# Altium schematic sheet USB_INT.SchDoc
size A4; SheetNumber: 7; SheetTotal: 7
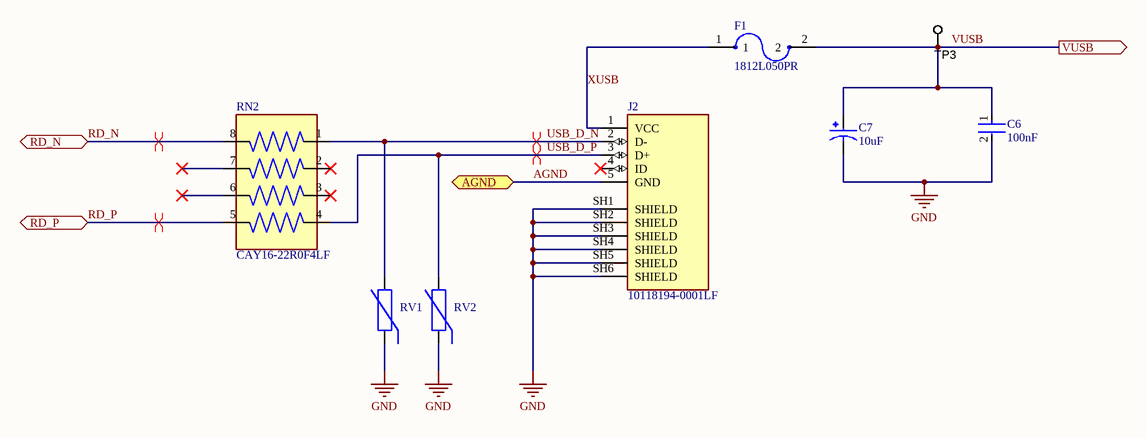
[diagram p0: USB_INT.SchDoc]

## Parts
C6  100nF  [FP-GRT31C-0_2-MFG]
C7  10uF  [CAP_EEEHB1C100AR]
F1  1812L050PR  [FUSM4632X75]
J2  10118194-0001LF  [AMPHENOL_10118194-0001LF]
RN2  CAY16-22R0F4LF  [RESCAF80P320X160X60-8N]
RV1  CG0603MLC-05E  [BOUR-CG0603-2_V]  (value not drawn)
RV2  CG0603MLC-05E  [BOUR-CG0603-2_V]  (value not drawn)
TP3  TESTPOINT_SMD_C1  [TPSMD_C60]  (value not drawn)  (no BOM)

## Ports
AGND (bidir, see OVERVIEW[1D], MCU[2C]), RD_N (bidir, see OVERVIEW[1C], MCU[1B]), RD_P (bidir, see OVERVIEW[1C], MCU[1B]), VUSB (out, see OVERVIEW[1C], MCU[1B], POWER[1B])

## Nets
GND: C6.2 C7.2 J2.SH1(SHIELD) J2.SH2(SHIELD) J2.SH3(SHIELD) J2.SH4(SHIELD) J2.SH5(SHIELD) J2.SH6(SHIELD) RV1.1 RV2.1
AGND: J2.5(GND) ; port AGND
RD_N: RN2.8 ; port RD_N
RD_P: RN2.5 ; port RD_P
USB_D_N: J2.2(D-) RN2.1 RV1.2
USB_D_P: J2.3(D+) RN2.4 RV2.2
VUSB: C6.1 C7.1 F1.2 TP3.1 ; port VUSB
XUSB: F1.1 J2.1(VCC)

Not connected (* = marked no-connect by the designer): J2 4(ID)*; RN2 2* 3* 6* 7*

## Layout directives
differential pair: USB_D_N, USB_D_P
differential pair; differential pair class RD: RD_N, RD_P

## Library data of the parts
C6 = CMP-06035-012780-1: Multi-Layer Ceramic Capacitor 100nF 50V C0G ±1% 1206 Emboss T/R
C7 = EEEHB1C100AR: 10ÂµF 16V Aluminum Electrolytic Capacitors Radial, Can - SMD 2000 Hrs @ 105Â°C; MP: EEE-HB1C100AR; MF: Panasonic; SnapEDA_Link: https://www.snapeda.com/parts/EEE-HB1C100AR/Panasonic/view-part/?ref=snap; Availability: In Stock; Purchase-URL: https://pricing.snapeda.com/search/part/EEE-HB1C100AR/?ref=eda; Price: None; Check_prices: https://www.snapeda.com/parts/EEE-HB1C100AR/Panasonic/view-part/?ref=eda; Value: *; Package: RADIAL-2 Panasonic
F1 = 1812L050PR: Polymeric PTC Resettable Fuse 15V 500mA Ih Surface Mount 1812 (4532 Metric), Concave; MF: Littelfuse Inc.; Price: None; MP: 1812L050PR; SnapEDA_Link: https://www.snapeda.com/parts/1812L050PR/Littelfuse%20Inc./view-part/46902/?ref=snap; Check_prices: https://www.snapeda.com/parts/1812L050PR/Littelfuse%20Inc./view-part/46902/?ref=eda; Package: 1812 Littelfuse Inc.; Availability: Good; Value: *; Purchase-URL: https://pricing.snapeda.com/search/part/1812L050PR/?ref=eda
J2 = 10118194-0001LF: Micro USB, Input Output Connectors, B TYPE RECEPTACLE with flange; MF: Amphenol ICC; SnapEDA_Link: https://www.snapeda.com/parts/10118194-0001LF/Amphenol+FCI/view-part/?ref=snap; Package: None; Value: *; MP: 10118194-0001LF; Check_prices: https://www.snapeda.com/parts/10118194-0001LF/Amphenol+FCI/view-part/?ref=eda
RN2 = CAY16-22R0F4LF: 22 Ohm Â±1% 62.5mW Power Per Element Isolated 4 Resistor Network/Array Â±200ppm/Â°C 1206 (3216 Metric), Convex, Long Side Terminals; MF: Bourns; SnapEDA_Link: https://www.snapeda.com/parts/CAY16-22R0F4LF/Bourns/view-part/?ref=snap; Package: NON STANDARD-8 Bourns; Value: *; MP: CAY16-22R0F4LF; Check_prices: https://www.snapeda.com/parts/CAY16-22R0F4LF/Bourns/view-part/?ref=eda
RV1 RV2 = CMP-0584-00001-2: ESD Protector, 5 V Supply, -40 to 85 degC, 1.6 x 0.8 x 0.55 mm SMD, RoHS, Tape and Reel; Manufacturer: Bourns; VC: 20 V; VT: 150 V; RT: 1 ns; VDC: 5 V; CO: 0.5 pF; PartNumber: CG0603MLC-05E; ComponentLink1Description: Manufacturer URL; ComponentLink1URL: http://www.bourns.com/; Packing: Tape and Reel; Mounting Technology: Surface Mount; ComponentLink2Description: Datasheet; RoHS: TRUE; Operating Temperature: -40 to 85 degC; DatasheetVersion: Rev. S; PackageDescription: 2-Pin SMD, Body 1.6 x 0.8 mm, Pitch 1.52 mm; PackageReference: CG0603-2; ComponentLink2URL: http://www.bourns.com/data/global/pdfs/MLC.pdf
  RV2: ComponentLink3Description: New link; ComponentLink3URL: *
TP3 = TESTPOINT_SMD_C1: TEST POINT; MANF: MANF; MANF_P#: MANF_P#; VALUE: VALUE